# EAGLE schematic Swarm Bot Overall (EAGLE 6.2)
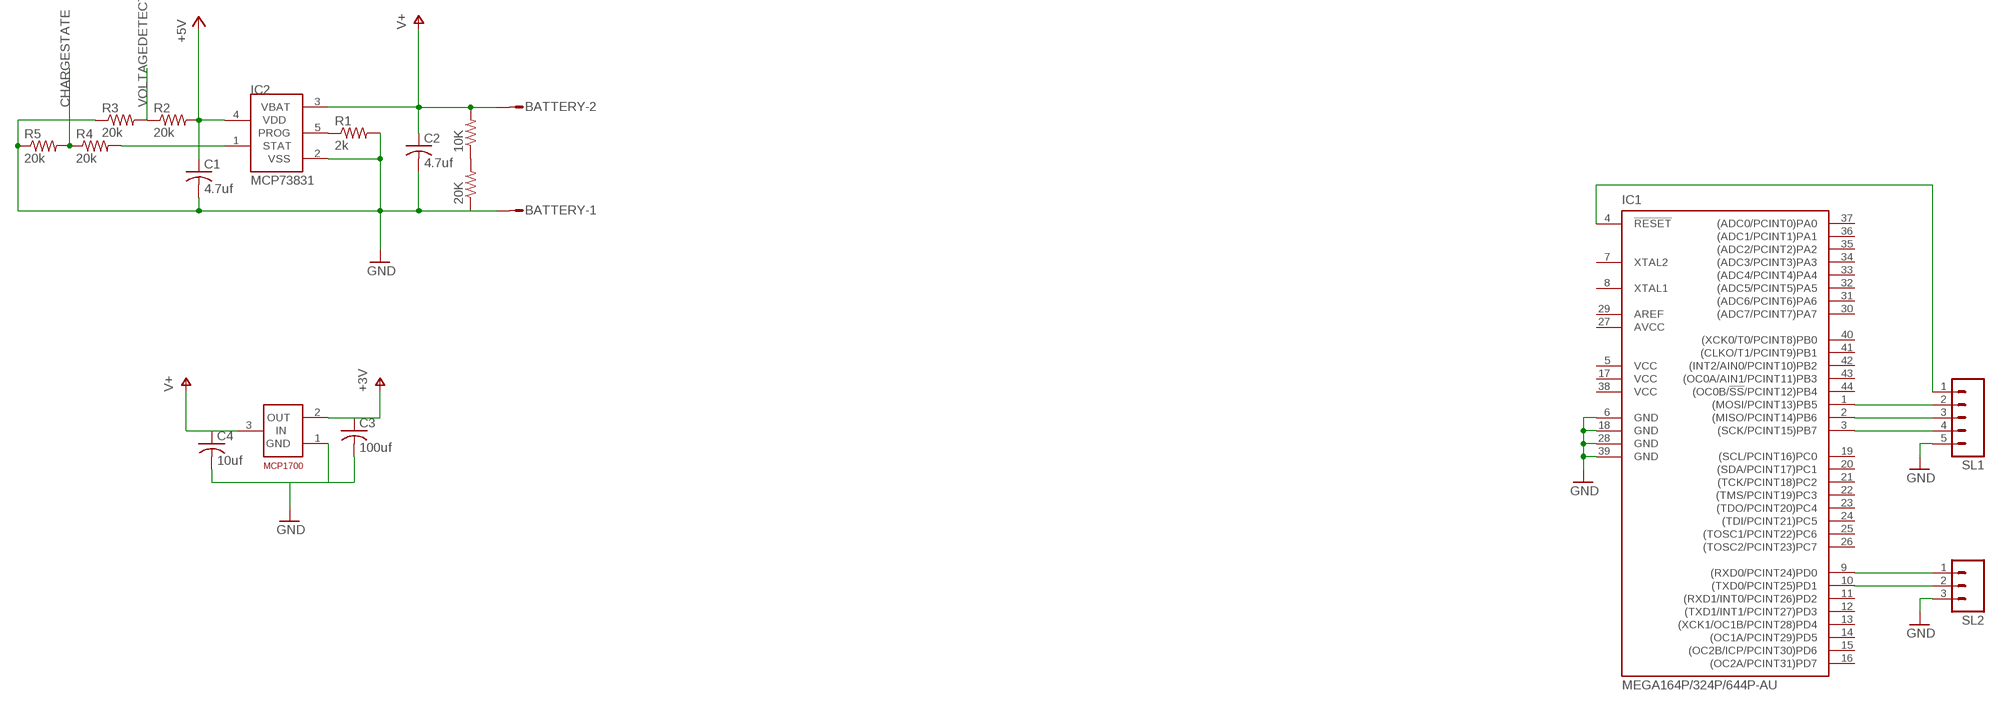
[diagram p0: schematic, sheet 1]

## Parts
10K  R-US_0204/5  [0204/5]
20K  R-US_0204/5  [0204/5]
BATTERY  M02S  [02P]
C1  4.7uf  C-US025-050X050  [C025-050X050]
C2  4.7uf  C-US050-025X075  [C050-025X075]
C3  100uf  C-US025-050X050  [C025-050X050]
C4  10uf  C-US025-050X050  [C025-050X050]
IC1  MEGA164P/324P/644P-AU  [TQFP44]
IC2  MCP73831  [SOT23-5L]
R1  2k  R-US_0204/5  [0204/5]
R2  20k  R-US_0204/5  [0204/5]
R3  20k  R-US_0204/5  [0204/5]
R4  20k  R-US_0204/5  [0204/5]
R5  20k  R-US_0204/5  [0204/5]
SL1  M05  [05P]
SL2  M03  [03P]
U$1  MCP1700T-3002E/TT  [SOT23]

## Nets
3V: U$1.2(OUT) ; supply symbol labelled +3V
+5V: C1.1 IC2.4(VDD) R2.2
CHARGESTATE: R4.1 R5.2
GND: BATTERY.1 C1.2 C2.2 C3.2 C4.2 IC1.6(GND) IC1.18(GND) IC1.28(GND) IC1.39(GND) IC2.2(VSS) R1.2 R3.1 R5.1 SL1.5 SL2.3 U$1.1(GND)
N$1: IC2.5(PROG) R1.1
N$2: IC1.10((TXD0/PCINT25)PD1) SL2.2
N$3: 10K.1 20K.2
N$4: IC1.9((RXD0/PCINT24)PD0) SL2.1
N$5: IC1.1((MOSI/PCINT13)PB5) SL1.2
N$6: IC2.1(STAT) R4.2
N$7: IC1.2((MISO/PCINT14)PB6) SL1.3
N$8: IC1.3((SCK/PCINT15)PB7) SL1.4
N$9: IC1.4(!RESET) SL1.1
V+: 10K.2 BATTERY.2 C2.1 IC2.3(VBAT) U$1.3(IN)
VOLTAGEDETECT: R2.1 R3.2
Unconnected: 20K.1 C3.1 C4.1 IC1.7(XTAL2) IC1.8(XTAL1) IC1.11((RXD1/INT0/PCINT26)PD2) IC1.12((TXD1/INT1/PCINT27)PD3) IC1.13((XCK1/OC1B/PCINT28)PD4) IC1.14((OC1A/PCINT29)PD5) IC1.15((OC2B/ICP/PCINT30)PD6) IC1.16((OC2A/PCINT31)PD7) IC1.19((SCL/PCINT16)PC0) IC1.20((SDA/PCINT17)PC1) IC1.21((TCK/PCINT18)PC2) IC1.22((TMS/PCINT19)PC3) IC1.23((TDO/PCINT20)PC4) IC1.24((TDI/PCINT21)PC5) IC1.25((TOSC1/PCINT22)PC6) IC1.26((TOSC2/PCINT23)PC7) IC1.30((ADC7/PCINT7)PA7) IC1.31((ADC6/PCINT6)PA6) IC1.32((ADC5/PCINT5)PA5) IC1.33((ADC4/PCINT4)PA4) IC1.34((ADC3/PCINT3)PA3) IC1.35((ADC2/PCINT2)PA2) IC1.36((ADC1/PCINT1)PA1) IC1.37((ADC0/PCINT0)PA0) IC1.40((XCK0/T0/PCINT8)PB0) IC1.41((CLKO/T1/PCINT9)PB1) IC1.42((INT2/AIN0/PCINT10)PB2) IC1.43((OC0A/AIN1/PCINT11)PB3) IC1.44((OC0B/!SS!/PCINT12)PB4)

## Power pins joined to a net without a drawn wire
AREF: IC1.29(AREF)
AVCC: IC1.27(AVCC)
VCC: IC1.5(VCC) IC1.17(VCC) IC1.38(VCC)

## Library data of the parts
10K 20K R1-R5 = resistor:R-US_: RESISTOR, American symbol
BATTERY = con-amp-quick:M02S: AMP QUICK CONNECTOR; OC_FARNELL: unknown; OC_NEWARK: unknown
C1-C4 = resistor:C-US: CAPACITOR, American symbol
IC1 = avr-5:MEGA164P/324P/644P-AU
IC2 = microchip-update-2:MCP73831: Miniature Single-Cell, Fully Integrated Li-Ion, Li-Polymer Charge Management Controllers
SL1 = con-amp-quick:M05: AMP QUICK CONNECTOR; OC_FARNELL: unknown; OC_NEWARK: unknown
SL2 = con-amp-quick:M03: AMP QUICK CONNECTOR; OC_FARNELL: unknown; OC_NEWARK: unknown
U$1 = SwarmParts:MCP1700T-3002E/TT